# Altium schematic sheet Actuators.SchDoc: Actuators
size A3; SheetNumber: 5; SheetTotal: 10
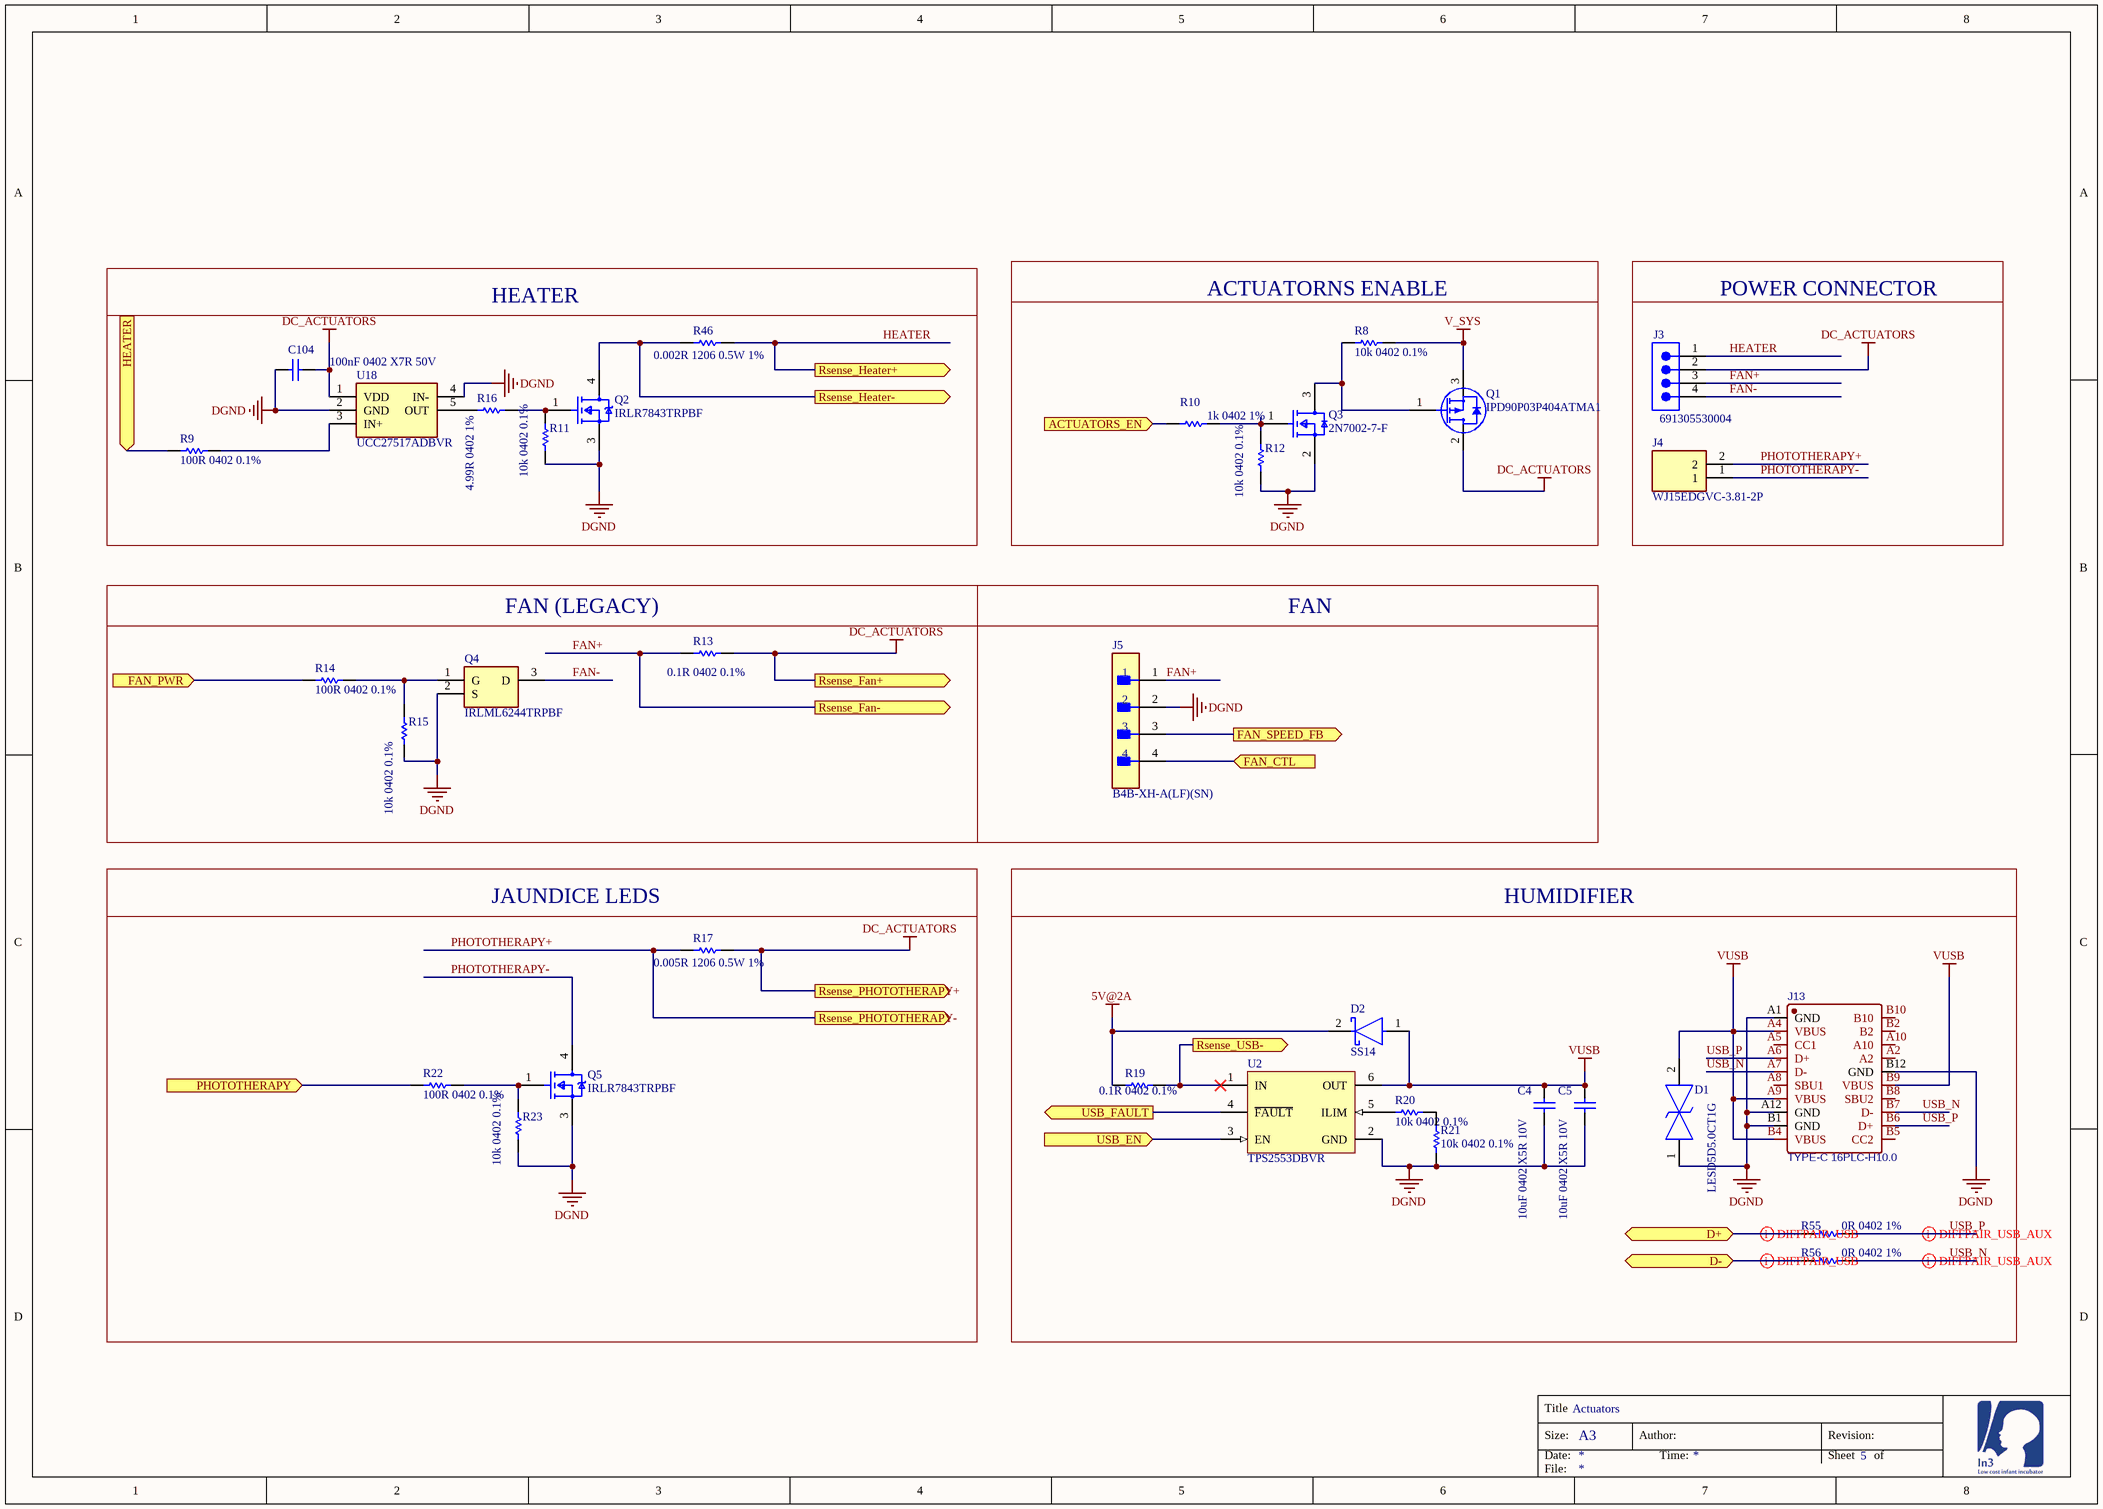
[diagram p0: Actuators.SchDoc]

## Parts
C4  10uF 0402 X5R 10V  [CAPC1005X55X25NL5T10]
C5  10uF 0402 X5R 10V  [CAPC1005X55X25NL5T10]
C104  100nF 0402 X7R 50V  [CAPC1005X55X25NL5T10]
D1  LESD5D5.0CT1G  [LESD5D50CT1G]
D2  SS14  [FP-403AE-MFG]
J3  691305530004  [691305530004]
J4  WJ15EDGVC-3.81-2P  [SHDR2W85P0X381_1X2_850X700X935P]
J5  B4B-XH-A(LF)(SN)  [FP-B4B-XH-A_LF_SN-MFG]
J13  TYPE-C 16PLC-H10.0  [TYPE-C-TH_16PLC-H10.0]
Q1  IPD90P03P404ATMA1  [DPAK IPD90P03P404ATMA1]
Q2  IRLR7843TRPBF  [FP-PG-TO252-3-MFG]
Q3  2N7002-7-F  [FP-SOT23-MFG]
Q4  IRLML6244TRPBF  [SOT95P237X112-3N]
Q5  IRLR7843TRPBF  [FP-PG-TO252-3-MFG]
R8  10k 0402 0.1%  [RESC1005X40X25ML05T10]
R9  100R 0402 0.1%  [RESC1005X40X25ML05T10]
R10  1k 0402 1%  [RESC1005X40X25ML05T10]
R11  10k 0402 0.1%  [RESC1005X40X25ML05T10]
R12  10k 0402 0.1%  [RESC1005X40X25ML05T10]
R13  0.1R 0402 0.1%  [RESC1005X40X25ML05T10]
R14  100R 0402 0.1%  [RESC1005X40X25ML05T10]
R15  10k 0402 0.1%  [RESC1005X40X25ML05T10]
R16  4.99R 0402 1%  [RESC1005X40X25ML05T10]
R17  0.005R 1206 0.5W 1%  [CAPC3216X180X55ML20T25]
R19  0.1R 0402 0.1%  [RESC1005X40X25ML05T10]
R20  10k 0402 0.1%  [RESC1005X40X25ML05T10]
R21  10k 0402 0.1%  [RESC1005X40X25ML05T10]
R22  100R 0402 0.1%  [RESC1005X40X25ML05T10]
R23  10k 0402 0.1%  [RESC1005X40X25ML05T10]
R46  0.002R 1206 0.5W 1%  [CAPC3216X180X55ML20T25]
R55  0R 0402 1%  [RESC1005X40X25ML05T10]
R56  0R 0402 1%  [RESC1005X40X25ML05T10]
U2  TPS2553DBVR  [DBV0006A_M]
U18  UCC27517ADBVR  [SOT95P280X145-5N]

## Blocks framed on the sheet
HEATER: C104 Q2 R9 R11 R16 R46 U18
ACTUATORNS ENABLE: Q1 Q3 R8 R10 R12
POWER CONNECTOR: J3 J4
FAN: J5
FAN (LEGACY): Q4 R13-R15
JAUNDICE LEDS: Q5 R17 R22 R23
HUMIDIFIER: C4 C5 D1 D2 J13 R19-R21 R55 R56 U2

## Ports
ACTUATORS_EN (in), D+ (bidir), D- (bidir), FAN_CTL (in), FAN_PWR (in), FAN_SPEED_FB (out), HEATER (in), PHOTOTHERAPY (in), Rsense_Fan+ (out), Rsense_Fan- (out), Rsense_Heater+ (out), Rsense_Heater- (out), Rsense_PHOTOTHERAPY+ (out), Rsense_PHOTOTHERAPY- (out), Rsense_USB- (out), USB_EN (in), USB_FAULT (out)

## Nets
5V@2A: D2.2(C) R19.1
DC_ACTUATORS: C104.1 J3.2 Q1.2(D) R13.2 R17.1 U18.1(VDD) ; port Rsense_PHOTOTHERAPY+, port Rsense_Fan+
DGND: C4.1 C5.1 C104.2 D1.1 J5.2 J13.A1(GND) J13.A12(GND) J13.B1(GND) J13.B12(GND) Q2.3(SOURCE) Q3.2(S) Q4.2(S) Q5.3(SOURCE) R11.1 R12.1 R15.1 R21.1 R23.1 U2.2(GND) U18.2(GND) U18.4(IN-)
V_SYS: Q1.3(S) R8.1
VUSB: C4.2 C5.2 D1.2 D2.1(A) J13.A4(VBUS) J13.A9(VBUS) J13.B4(VBUS) J13.B9(VBUS) U2.6(OUT)
ACTUATORS_EN: R10.2 ; port ACTUATORS_EN
D+: R55.2 ; port D+
D-: R56.2 ; port D-
FAN+: J3.3 J5.1 R13.1 ; port Rsense_Fan-
FAN-: J3.4 Q4.3(D)
FAN_CTL: J5.4 ; port FAN_CTL
FAN_PWR: R14.1 ; port FAN_PWR
FAN_SPEED_FB: J5.3 ; port FAN_SPEED_FB
HEATER: J3.1 R46.1 ; port Rsense_Heater+
HEATER: R9.1 ; port HEATER  [a separate net that carries the same name]
PHOTOTHERAPY: R22.1 ; port PHOTOTHERAPY
PHOTOTHERAPY+: J4.2 R17.2 ; port Rsense_PHOTOTHERAPY-
PHOTOTHERAPY-: J4.1 Q5.4(DRAIN)
Rsense_Heater-: Q2.4(DRAIN) R46.2 ; port Rsense_Heater-
Rsense_USB-: R19.2 U2.1(IN) ; port Rsense_USB-
USB_EN: U2.3(EN) ; port USB_EN
USB_FAULT: U2.4(~{FAULT}) ; port USB_FAULT
USB_N: J13.A7(D-) J13.B7(D-) R56.1
USB_P: J13.A6(D+) J13.B6(D+) R55.1
NetQ1_1: Q1.1(G) Q3.3(D) R8.2
NetQ2_1: Q2.1(GATE) R11.2 R16.1
NetQ3_1: Q3.1(G) R10.1 R12.2
NetQ4_1: Q4.1(G) R14.2 R15.2
NetQ5_1: Q5.1(GATE) R22.2 R23.2
NetR9_2: R9.2 U18.3(IN+)
NetR16_2: R16.2 U18.5(OUT)
NetR20_1: R20.1 R21.2
NetR20_2: R20.2 U2.5(ILIM)

Not connected (* = marked no-connect by the designer): J13 A2 A5(CC1) A8(SBU1) A10 B2 B5(CC2) B8(SBU2) B10

## Layout directives
differential pair; differential pair class USB_AUX: USB_N, USB_P
differential pair; differential pair class USB: D+, D-

## Notes on the sheet
- Title
- Size:
- Date:
- A3
- Author:
- Time:
- Revision:
- Sheet
- of
- File:

## Library data of the parts
C4 C5 C104 = CMP-1662-00020-1: ComponentLink2Description: Datasheet; ComponentLink2URL: http://psearch.en.murata.com/capacitor/product/GRM155R60J105KE19%23.pdf; ComponentLink1Description: Manufacturer URL; ComponentLink1URL: http://www.murata.com/
  C4 C5: LCSC_PN: C77000
  C104: LCSC_PN: C77020
D1 = LESD5D5.0CT1G: TVS Diode (Bi-directional); Manufacturer_Name: LRC; Height: 0.7mm; Manufacturer_Part_Number: LESD5D5.0CT1G; LCSC_PN: C383211
D2 = CMP-2000-04943-2: DIODE SCHOTTKY 40V 1A SMA; Manufacturer: ON Semiconductor; Peak Reverse Current: 0.2mA; Max Junction Temp: +125°C; Standoff Height: 0.05mm; Max Surge Forward Current: 40A; Mouser Description: Schottky Diodes & Rectifiers SMA 40V 1.0A; RoHS: TRUE; Lead Free: Yes; Manufacturer Part Number: SS14; Device Class L3: Schottky Diodes; Category: Diode; Automotive: No; Digikey Description: DIODE SCHOTTKY 40V 1A SMA; ComponentLink2Description: Datasheet; Device Class L2: Diodes; Height: 2.5mm; Temperature Range High: +125°C; ComponentLink2URL: https://www.onsemi.com/pub/Collateral/SS19-D.PDF; Device Class L1: Discrete Semiconductors; Package: 403AE; Octopart: https://octopart.com/ss14-on+semiconductor-29205033; Max Repetitive Reverse Voltage: 40V; Temperature Range Low: -65°C; Forward Current: 1A; Temperature: -65°C to +125°C; LCSC_PN: C2480
J3 = CMP-03913-99613968-2: Terminal Block PCB Header with Plastic Latches, Through Hole, 5.08mm Pitch, Straight, 4 Poles; LCSC_PN: C441388
J4 = WJ15EDGVC-3.81-2P: Connector; Manufacturer_Name: Ningbo Kangnex; Datasheet Link: https://datasheet.lcsc.com/szlcsc/Ningbo-Kangnex-Elec-WJ15EDGVC-3-81-2P_C8396.pdf; Height: 9.35mm; Manufacturer_Part_Number: WJ15EDGVC-3.81-2P; LCSC_PN: C22365241
J5 = CMP-17439-000250-1: CONN HEADER VERT 4POS 2.5MM; Number of Contacts: 4; Contact Resistance: 20mR; Voltage Rating: 250V; Max Current Rating: 3A; Gender: Male; Wire/Cable Gauge: 22AWG; Mated Stacking Heights: 9.8mm; Insulation Resistance: 1GR; Orientation: Straight; Contact Type: Male Pin; Contact Finish - Mating: TIN; Series: XH; Max Voltage Rating (AC): 250V; Lead Pitch: 2.5mm; Contact Shape: Square; Insulation Color: Natural; Termination: Solder; Lead Free: Lead Free; Voltage Rating (AC): 250V; Number of Rows: 1; Flammability Rating: UL94 V-0; Number of Positions: 4; Max Operating Temperature: 85°C; Package Quantity: 500; Mount: Through Hole; REACH SVHC: No SVHC; Connector Type: Header; Insulation Material: Nylon; Fastening Type: Detent; Min Operating Temperature: -25°C; Housing Color: White; Packaging: Bulk; Contact Plating: Tin; Contact Material: Brass; Max Voltage Rating (DC): 250V; Housing Material: Polyamide; Color: Natural; Material: Polyamide; Pitch: 2.5mm; Depth: 5.75mm; Current Rating: 3A; Length: 12.4mm; LCSC_PN: C144395
J13 = TYPE-C 16PLC-H10.0: Manufacturer: SHOU HAN(首韩); Contributor: lcsc; Supplier: LCSC; Supplier Part: C3151747; Manufacturer Part: TYPE-C 16PLC-H10.0; JLCPCB Part Class: Extended Part; spicePre: U; spiceSymbolName: TYPE-C 16PLC-H10.0; LCSC_PN: C3151747
Q1 = CMP-3103264-6: Single P-Channel 30 V 4.5 mOhm 100 nC OptiMOS Power Mosfet - TO-252-3-11; Lead-Free Status: Lead Free; REACH SVHC Compliance: No SVHC; Octopart URL: https://octopart.com/ipd90p03p404atma1-infineon-21386769; Polarity: P-Channel; RoHS: Compliant; Mounting Style: Surface Mount; Operating Temperature: 175 °C (max); Packaging: Reel; Number of Pins: 3; OctopartID: f6ad3ee185da296a; Manufacturer Part Number: IPD90P03P404ATMA1; Manufacturer Part Number 2: WSF70P03; LCSC_PN: C845609
Q2 Q5 = CMP-32901-000143-1: MOSFET N-CH 30V 161A DPAK; Manufacturer: Infineon; Drain To Source Resistance: 3.2mΩ; Depletion Mode: False; Reverse Recovery Time: 39ns; Reverse Recovery Charge: 36nC; Threshold Vgs Max: 2.3V; Rthja Max: 50°C/W; Threshold Vgs Min: 1.4V; Power Dissipation: 140W; Pulse Drain Current: 620A; Input Capacitace At Vds: 4380pF @ 15V; Turn On Delay Time: 25ns; Gate To Source Voltage: 20V; Max Forward Diode Voltage: 1V; Gate Charge At Vgs: 34nC @ 4.5V; Max Junction Temp: +175°C; Number Of Channels: 1; Turn Off Delay Time: 34ns; ComponentLink2URL: https://www.infineon.com/dgdl/irlr7843pbf.pdf?fileId=5546d462533600a40153566de53526d8; Temperature Range High: +175°C; Octopart: https://octopart.com/irlr7843trpbf-infineon-65875062; Temperature: -55°C to +175°C; Device Class L3: MOSFETs; Manufacturer Part Number: IRLR7843TRPBF; Category: Trans; Package: PG-TO252-3; Footprint Url: https://www.infineon.com/cms/en/product/packages/PG-TO252/PG-TO252-3-901/; Continuous Drain Current: 161A; Digikey Description: MOSFET N-CH 30V 161A DPAK; Automotive: No; Lead Free: Yes; Drain To Source Breakdown Voltage: 30V; Height: 2.52mm; Temperature Range Low: -55°C; RoHS: TRUE; Number Of N Channels: 1; Drain To Source Voltage: 30V; ComponentLink2Description: Datasheet; Device Class L2: Transistors; Device Class L1: Discrete Semiconductors; LCSC_PN: C21988
Q3 = CMP-2000-04929-2: MOSFET N-CH 60V 115MA SOT23-3; Turn-On Delay Time: 7ns; Turn-Off Delay Time: 11ns; Drain to Source Resistance: 7.5R; Rise Time: 3ns; Drain to Source Breakdown Voltage: 70V; Input Capacitance: 50pF; Number of Elements: 1; Power Dissipation: 540mW; Max Power Dissipation: 300mW; Fall Time: 5.6ns; Gate to Source Voltage (Vgs): 20V; Threshold Voltage: 2.5V; Element Configuration: Single; Termination: SMD/SMT; Weight: 0.000282oz; Radiation Hardening: No; Max Operating Temperature: 150°C; On-State Resistance: 7.5R; Mount: Surface Mount; Current Rating: 115mA; Contact Plating: Tin; Lead Free: Lead Free; Min Operating Temperature: -55°C; Number of Pins: 3; REACH SVHC: No SVHC; Drain to Source Voltage (Vdss): 60V; Width: 1.3mm; Package Quantity: 3000; Length: 2.9mm; Case/Package: SOT-23; Number of Channels: 1; Dual Supply Voltage: 60V; Packaging: Tape and Reel; Height: 1mm; Voltage Rating (DC): 60V; Nominal Vgs: 2.5V; Continuous Drain Current (ID): 115mA; Voltage: 60V; Rds On Max: 7.5R; LCSC_PN: C65189
Q4 = IRLML6244TRPBF: Transistor; Manufacturer_Name: Infineon; Datasheet Link: http://www.infineon.com/dgdl/irlml6244pbf.pdf?fileId=5546d462533600a4015356686fed261f; Height: 1.12mm; Manufacturer_Part_Number: IRLML6244TRPBF; Mouser Part Number: 942-IRLML6244TRPBF; Mouser Price/Stock: https://www.mouser.co.uk/ProductDetail/Infineon-IR/IRLML6244TRPBF?qs=9%252BKlkBgLFf1HkY%2F2U%252BIhLQ%3D%3D; Arrow Part Number: IRLML6244TRPBF; Arrow Price/Stock: https://www.arrow.com/en/products/irlml6244trpbf/infineon-technologies-ag?region=nac; LCSC_PN: C143946
R8-R16 R19-R23 R55 R56 = CMP-2002-07472-1
  R8 R11 R12 R15 R20 R21 R23: LCSC_PN: C190095
  R9 R14 R22: LCSC_PN: C106233
  R10: LCSC_PN: C106235
  R13 R19: LCSC_PN: C2139031
  R16: LCSC_PN: C844114
  R55 R56: LCSC_PN: C60485
R17 = CMP-0abdc173b10ad57a-1: Manufacturer Part Number: WSLP12065L000FEA; Resistance: 0,024; Power: 1W; Octopart URL: https://octopart.com/1-2176055-0-te+connectivity-46440145; Case/Package: 1206; Lifecycle Status: Not Listed by Manufacturer; Packaging: Tape & Reel (TR); OctopartID: 0abdc173b10ad57a; OrderingCode: WSLP12065L000FEA; Manufacturer Part Number 2: FMF06FTHR005-LHL; LCSC_PN: C728276
R46 = CMP-0abdc173b10ad57a-1: 0.005R 1206 0.5W 1%; Manufacturer Part Number: WSLP12065L000FEA; Resistance: 0,024; Power: 1W; Octopart URL: https://octopart.com/1-2176055-0-te+connectivity-46440145; Case/Package: 1206; Lifecycle Status: Not Listed by Manufacturer; Packaging: Tape & Reel (TR); OctopartID: 0abdc173b10ad57a; OrderingCode: WSLP12065L000FEA; Manufacturer Part Number 2: FMF06FTHR005-LHL; LCSC_PN: C728282
U2 = CMP-0337-00284-2: Adjustable, Active High, Constant-Current, Current-Limited Power-Distribution Switch, 0.075 to 1.7 A Current Limit, -40 to 85 degC, 6-pin SOT-23 (DBV), Green (RoHS & no Sb/Br); Manufacturer: Texas Instruments; Continuous Current(Max)(A): 1.5; Vin(Min)(V): 2.5; Current Limit Accuracy @ 1A: +/-7.5% (925mA min / 1075mA max); Vin(Max)(V): 6.5; Rating: Catalog; rDS(on) per FET(Typ)(mOhms): 100/DRV, 85/DBV; Number of Switches: 1; ComponentLink1Description: Datasheet; PartNumber: TPS2553DBVR; Enable: Active High; PackageDescription: 6-Pin Plastic Small-Outline Package, 2.9 x 1.6 mm Body, 0.95 mm Pitch, 2.8 mm Lead Span; DatasheetVersion: SLVS841E; Code_JEDEC: MO-178-AB*; Current Limit Topology: Constant-Current; Mounting Technology: Surface Mount; Eco-Plan: Green (RoHS & no Sb/Br); PackageVersion: revK, Mar-2006; PackageReference: DBV0006A; ComponentLink1URL: http://www.ti.com/general/docs/lit/getliterature.tsp?genericPartNumber=TPS2553&fileType=pdf; Current Limit(A): 0.075 to 1.7; LCSC_PN: C55266
U18 = UCC27517ADBVR: Integrated Circuit; Manufacturer_Name: Texas Instruments; Datasheet Link: http://www.ti.com/lit/gpn/ucc27517a; Height: 1.45mm; Manufacturer_Part_Number: UCC27517ADBVR; Mouser Part Number: 595-UCC27517ADBVR; Mouser Price/Stock: https://www.mouser.co.uk/ProductDetail/Texas-Instruments/UCC27517ADBVR?qs=e5T%2FzGlhGOZhJZidb%252B7EgQ%3D%3D; Arrow Part Number: UCC27517ADBVR; Arrow Price/Stock: https://www.arrow.com/en/products/ucc27517adbvr/texas-instruments.html?utm_currency=USD&region=nac; LCSC_PN: C2653784